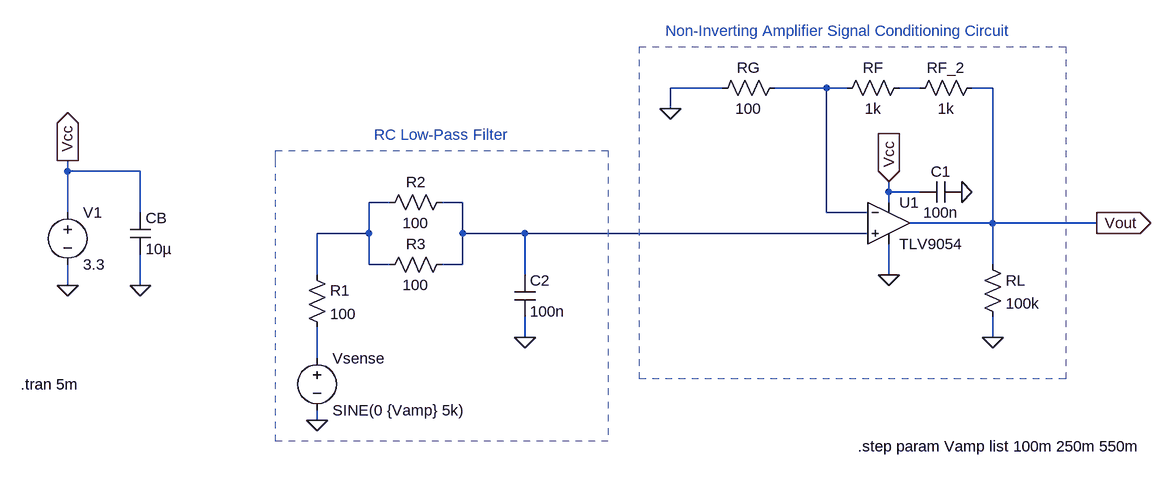
[diagram p0: schematic conditioning_circuit.asc]
conditioning_circuit.asc, the LTspice schematic file:
Version 4
SHEET 1 1712 680
WIRE 1024 -144 944 -144
WIRE 1184 -144 1104 -144
WIRE 1216 -144 1184 -144
WIRE 1328 -144 1296 -144
WIRE 1440 -144 1408 -144
WIRE 944 -112 944 -144
WIRE 16 -16 16 -32
WIRE 128 -16 16 -16
WIRE 1280 16 1280 0
WIRE 1328 16 1280 16
WIRE 512 32 480 32
WIRE 624 32 592 32
WIRE 1280 32 1280 16
WIRE 16 48 16 -16
WIRE 128 48 128 -16
WIRE 1184 48 1184 -144
WIRE 1248 48 1184 48
WIRE 1440 64 1440 -144
WIRE 1440 64 1312 64
WIRE 1600 64 1440 64
WIRE 480 80 480 32
WIRE 480 80 400 80
WIRE 624 80 624 32
WIRE 720 80 624 80
WIRE 1248 80 720 80
WIRE 480 128 480 80
WIRE 512 128 480 128
WIRE 624 128 624 80
WIRE 624 128 592 128
WIRE 1440 128 1440 64
WIRE 400 144 400 80
WIRE 720 144 720 80
WIRE 1280 144 1280 96
WIRE 16 160 16 128
WIRE 128 160 128 112
WIRE 720 240 720 208
WIRE 1440 240 1440 208
WIRE 400 272 400 224
WIRE 400 368 400 352
FLAG 16 160 0
FLAG 128 160 0
FLAG 16 -32 Vcc
IOPIN 16 -32 Out
FLAG 400 368 0
FLAG 1280 144 0
FLAG 944 -112 0
FLAG 1280 0 Vcc
IOPIN 1280 0 In
FLAG 1392 16 0
FLAG 1440 240 0
FLAG 1600 64 Vout
IOPIN 1600 64 Out
FLAG 720 240 0
SYMBOL voltage 16 32 R0
SYMATTR InstName V1
SYMATTR Value 3.3
SYMBOL cap 112 48 R0
SYMATTR InstName CB
SYMATTR Value 10µ
SYMBOL voltage 400 256 R0
WINDOW 123 24 124 Left 2
WINDOW 39 0 0 Left 0
SYMATTR InstName Vsense
SYMATTR Value SINE(0 {Vamp} 5k)
SYMBOL res 1312 -160 R90
WINDOW 0 0 56 VBottom 2
WINDOW 3 32 56 VTop 2
SYMATTR InstName RF
SYMATTR Value 1k
SYMBOL res 1120 -160 R90
WINDOW 0 0 56 VBottom 2
WINDOW 3 32 56 VTop 2
SYMATTR InstName RG
SYMATTR Value 100
SYMBOL cap 1328 0 M90
WINDOW 0 0 32 VBottom 2
WINDOW 3 32 32 VTop 2
SYMATTR InstName C1
SYMATTR Value 100n
SYMBOL res 1424 112 R0
SYMATTR InstName RL
SYMATTR Value 100k
SYMBOL res 1424 -160 R90
WINDOW 0 0 56 VBottom 2
WINDOW 3 32 56 VTop 2
SYMATTR InstName RF_2
SYMATTR Value 1k
SYMBOL res 384 128 R0
SYMATTR InstName R1
SYMATTR Value 100
SYMBOL res 608 16 R90
WINDOW 0 0 56 VBottom 2
WINDOW 3 32 56 VTop 2
SYMATTR InstName R2
SYMATTR Value 100
SYMBOL res 608 112 R90
WINDOW 0 0 56 VBottom 2
WINDOW 3 32 56 VTop 2
SYMATTR InstName R3
SYMATTR Value 100
SYMBOL cap 704 144 R0
SYMATTR InstName C2
SYMATTR Value 100n
SYMBOL TLV9054 1280 64 R0
SYMATTR InstName U1
TEXT 1232 408 Left 2 !.step param Vamp list 100m 250m 550m
TEXT -56 312 Left 2 !.tran 5m
TEXT 488 -72 Left 2 ;RC Low-Pass Filter
TEXT 936 -232 Left 2 ;Non-Inverting Amplifier Signal Conditioning Circuit
LINE Normal 336 400 336 -32 2
LINE Normal 848 400 336 400 2
LINE Normal 848 -48 848 400 2
LINE Normal 336 -48 848 -48 2
LINE Normal 336 -32 336 -48 2
RECTANGLE Normal 1552 304 896 -208 2

The netlist it stands for:
* conditioning_circuit.asc
V1 Vcc 0 3.3
CB Vcc 0 10µ
Vsense N005 0 SINE(0 {Vamp} 5k)
RF N002 N001 1k
RG N001 0 100
C1 Vcc 0 100n
RL Vout 0 100k
RF_2 Vout N002 1k
R1 N003 N005 100
R2 N004 N003 100
R3 N004 N003 100
C2 N004 0 100n
* U1: TLV9054 (symbol TLV9054 not available, pins judged from their places): In+=N004 In-=N001 V+=Vcc V-=0 OUT=Vout
.step param Vamp list 100m 250m 550m
.tran 5m
* RC Low-Pass Filter
* Non-Inverting Amplifier Signal Conditioning Circuit
.backanno
.end